# EAGLE design ATtiny2313 pattern generator simple (EAGLE 5.06)
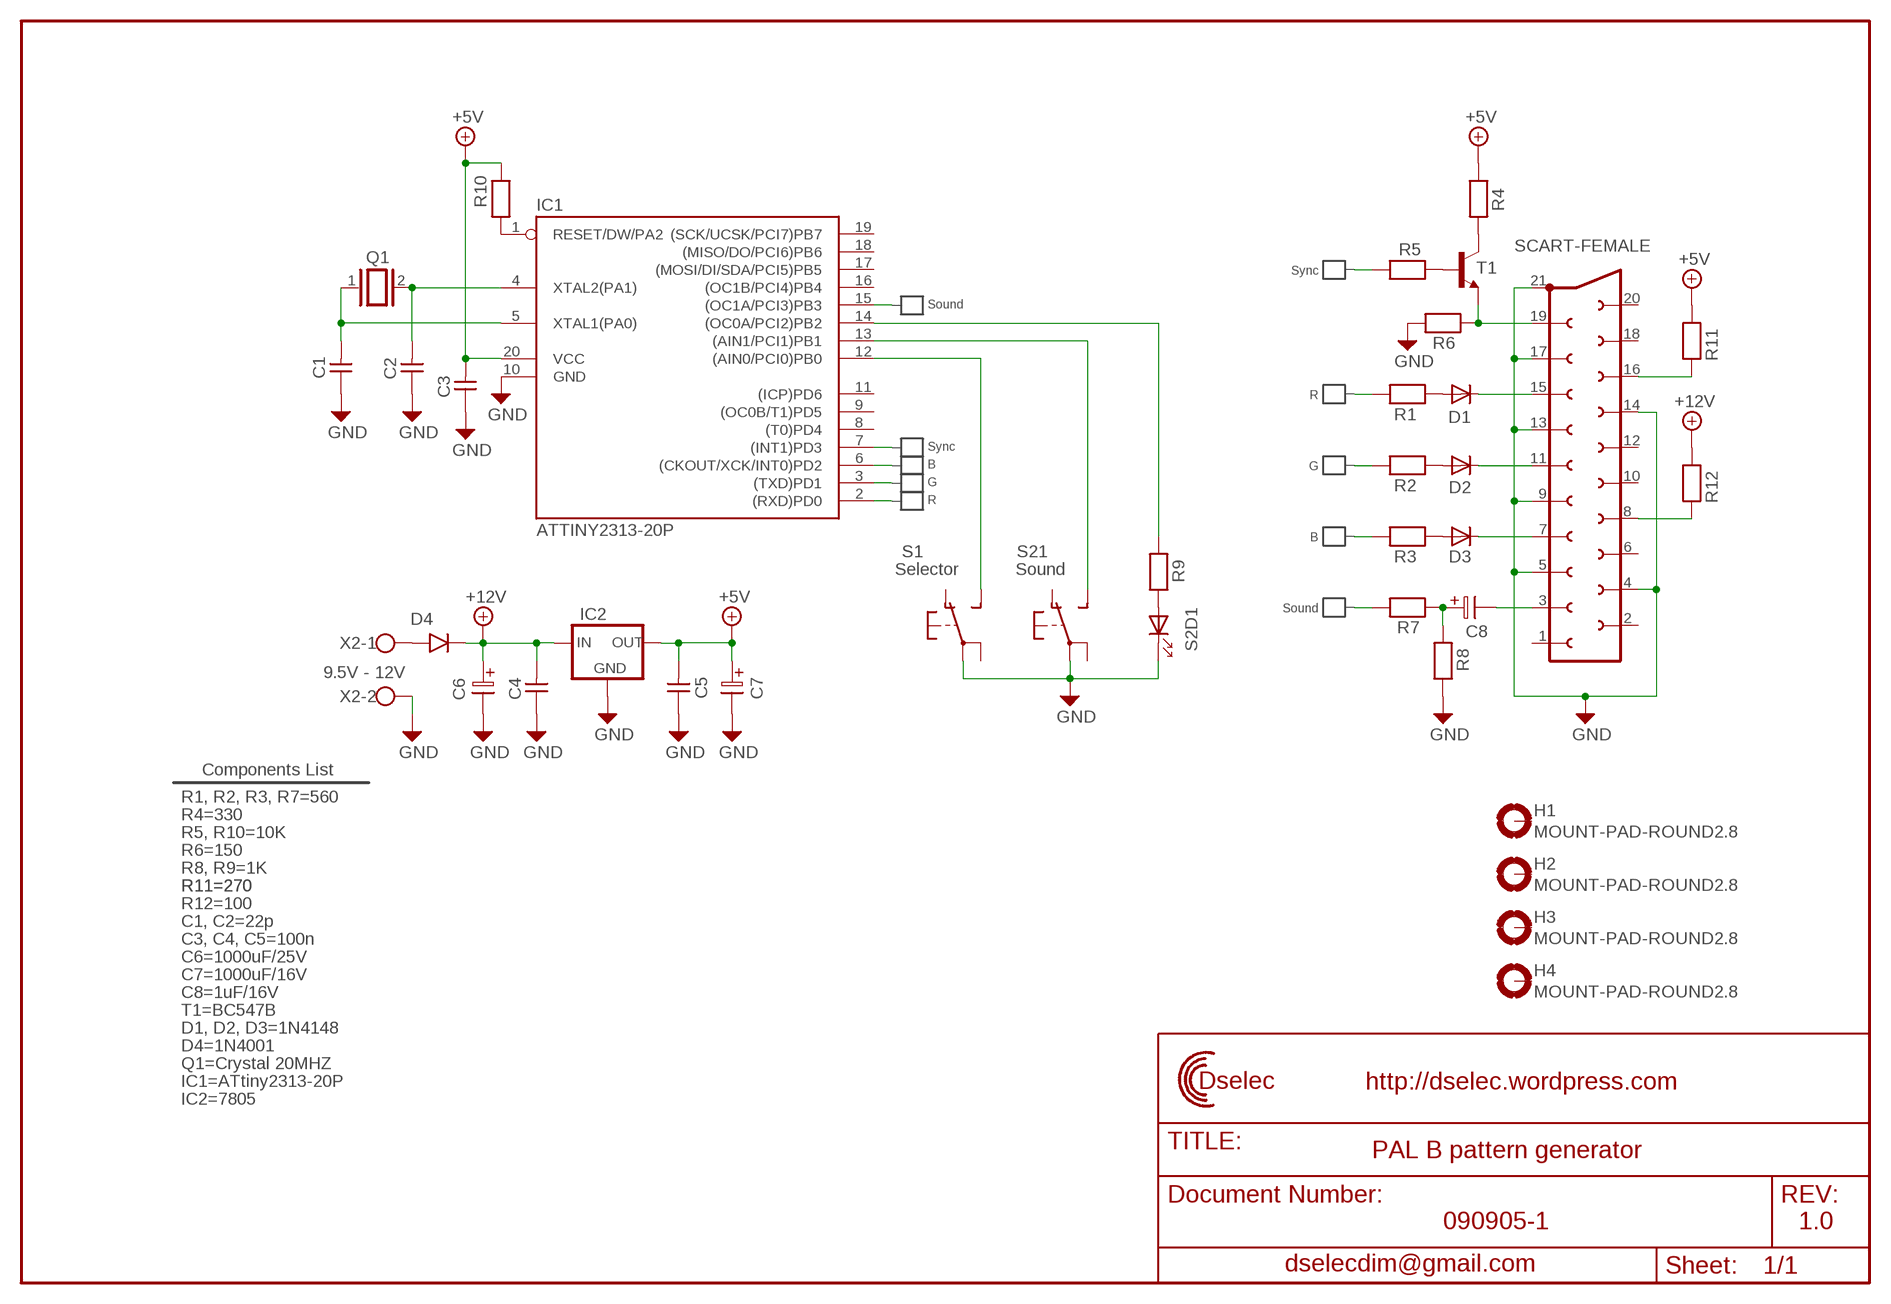
[diagram p0: schematic, sheet 1]

## Parts
C1  CAPNP-5  [C-5]
C2  CAPNP-5  [C-5]
C3  CAPNP-5  [C-5]
C4  CAPNP-5  [C-5]
C5  CAPNP-5  [C-5]
C6  ELC-5  [ES-5]
C7  ELC-5  [ES-5]
C8  ELC-2,5  [ES-2,5]
D1  1N4148  [DO35-10]
D2  1N4148  [DO35-10]
D3  1N4148  [DO35-10]
D4  1N4001  [DO41-10]
H1  MOUNT-PAD-ROUND2.8  [2,8-PAD]
H2  MOUNT-PAD-ROUND2.8  [2,8-PAD]
H3  MOUNT-PAD-ROUND2.8  [2,8-PAD]
H4  MOUNT-PAD-ROUND2.8  [2,8-PAD]
IC1  ATTINY2313-20P  [DIL20]
IC2  78XXS  [78XXS]
Q1  XTAL/S  [QS]
R1  RESEU-10  [R-10]
R2  RESEU-10  [R-10]
R3  RESEU-10  [R-10]
R4  RESEU-10  [R-10]
R5  RESEU-10  [R-10]
R6  RESEU-10  [R-10]
R7  RESEU-10  [R-10]
R8  RESEU-10  [R-10]
R9  RESEU-10  [R-10]
R10  RESEU-10  [R-10]
R11  RESEU-10  [R-10]
R12  RESEU-10  [R-10]
S1  Selector  SRK  [SRK]
S2  Sound  SRKL  [SRKL]
T1  BC547B  BC547B-NPN-TO92-EBC  [TO92-EBC]
X1  SCART-FEMALE  SCART-F  [SCART-F]
X2  AK500/2  [AK500/2]

## Nets
+5V: C3.2 C5.2 C7.1 IC1.20(VCC) IC2.OUT R4.1 R10.1 R11.1
+12V: C4.2 C6.1 D4.C(CATHODE) IC2.IN R12.1
BDRIVE: IC1.6((CKOUT/XCK/INT0)PD2) R3.2
BSCART: D3.A R3.1
GDRIVE: IC1.3((TXD)PD1) R2.2
GND: C1.1 C2.1 C3.1 C4.1 C5.1 C6.2 C7.2 IC1.10(GND) IC2.GND R6.2 R8.2 S1.2(P) S2.2(1:P) S2.-(D1:C) X1.4 X1.5 X1.9 X1.13 X1.14 X1.17 X1.21 X2.2
GSCART: D2.A R2.1
N$1: C2.2 IC1.4(XTAL2(PA1)) Q1.2
N$2: C1.2 IC1.5(XTAL1(PA0)) Q1.1
N$3: D1.C X1.15
N$4: D2.C X1.11
N$5: D3.C X1.7
N$6: C8.2 X1.3
N$7: IC1.1(RESET/DW/PA2) R10.2
N$8: C8.1 R7.2 R8.1
N$9: D4.A(ANODE) X2.1
N$12: R5.1 T1.B
N$13: R4.2 T1.C
N$15: IC1.13((AIN1/PCI1)PB1) S2.1(1:S)
N$16: IC1.12((AIN0/PCI0)PB0) S1.1(S)
N$17: R9.2 S2.+(D1:A)
N$18: IC1.14((OC0A/PCI2)PB2) R9.1
N$19: R11.2 X1.16
N$20: R12.2 X1.8
RDRIVE: IC1.2((RXD)PD0) R1.2
RSCART: D1.A R1.1
SND: IC1.15((OC1A/PCI3)PB3) R7.1
SYNCDRIVE: IC1.7((INT1)PD3) R5.2
SYNCSCART: R6.1 T1.E X1.19
Unconnected: H1.B2,8(MOUNT) H2.B2,8(MOUNT) H3.B2,8(MOUNT) H4.B2,8(MOUNT) IC1.8((T0)PD4) IC1.9((OC0B/T1)PD5) IC1.11((ICP)PD6) IC1.16((OC1B/PCI4)PB4) IC1.17((MOSI/DI/SDA/PCI5)PB5) IC1.18((MISO/DO/PCI6)PB6) IC1.19((SCK/UCSK/PCI7)PB7) S1.3(P) S1.4(O) S2.3(1:P) S2.4(1:O) X1.1 X1.2 X1.6 X1.10 X1.12 X1.18 X1.20

## Notes on the sheet
- 9.5V - 12V
- Components List
- R1, R2, R3, R7=560
- R4=330
- R5, R10=10K
- R6=150
- R8, R9=1K
- R11=270 | R11=270
- R12=100
- C1, C2=22p
- C3, C4, C5=100n
- C6=1000uF/25V
- C7=1000uF/16V
- C8=1uF/16V
- T1=BC547B
- D1, D2, D3=1N4148
- D4=1N4001
- Q1=Crystal 20MHZ
- IC1=ATtiny2313-20P
- IC2=7805
- PAL B pattern generator
- 090905-1 | 1.0

## Library data of the parts
C1-C5 = discrete:CAPNP-5
C6 C7 = discrete:ELC-5
C8 = discrete:ELC-2,5
D1-D3 = diode-1:1N4148: DIODE high speed (Philips)
D4 = tango:1N4001: DIODE general purpose rectifier, 1 A
H1-H4 = holes:MOUNT-PAD-ROUND: MOUNTING PAD, round
IC1 = avr:ATTINY2313: MICROCONTROLLER 2 Kbytes FLASH 128 bytes SRAM 128 bytes EEPROM USART USI
IC2 = v-reg:78XXS: VOLTAGE REGULATOR
Q1 = special:XTAL/S: CRYSTAL
R1-R12 = discrete:RESEU-10
S1 = switch-misc:SRK: SWITCH
S2 = switch-misc:SRKL: SWITCH
T1 = transistor:*-NPN-: NPN Transistror BF959 corrected 2008.03.06
X1 = con-hirschmann:SCART-F: TV SCART CONNECTOR
X2 = con-ptr500+(1):AK500/2: CONNECTOR

## Net classes
0 default: width 0.406 mm

## Board
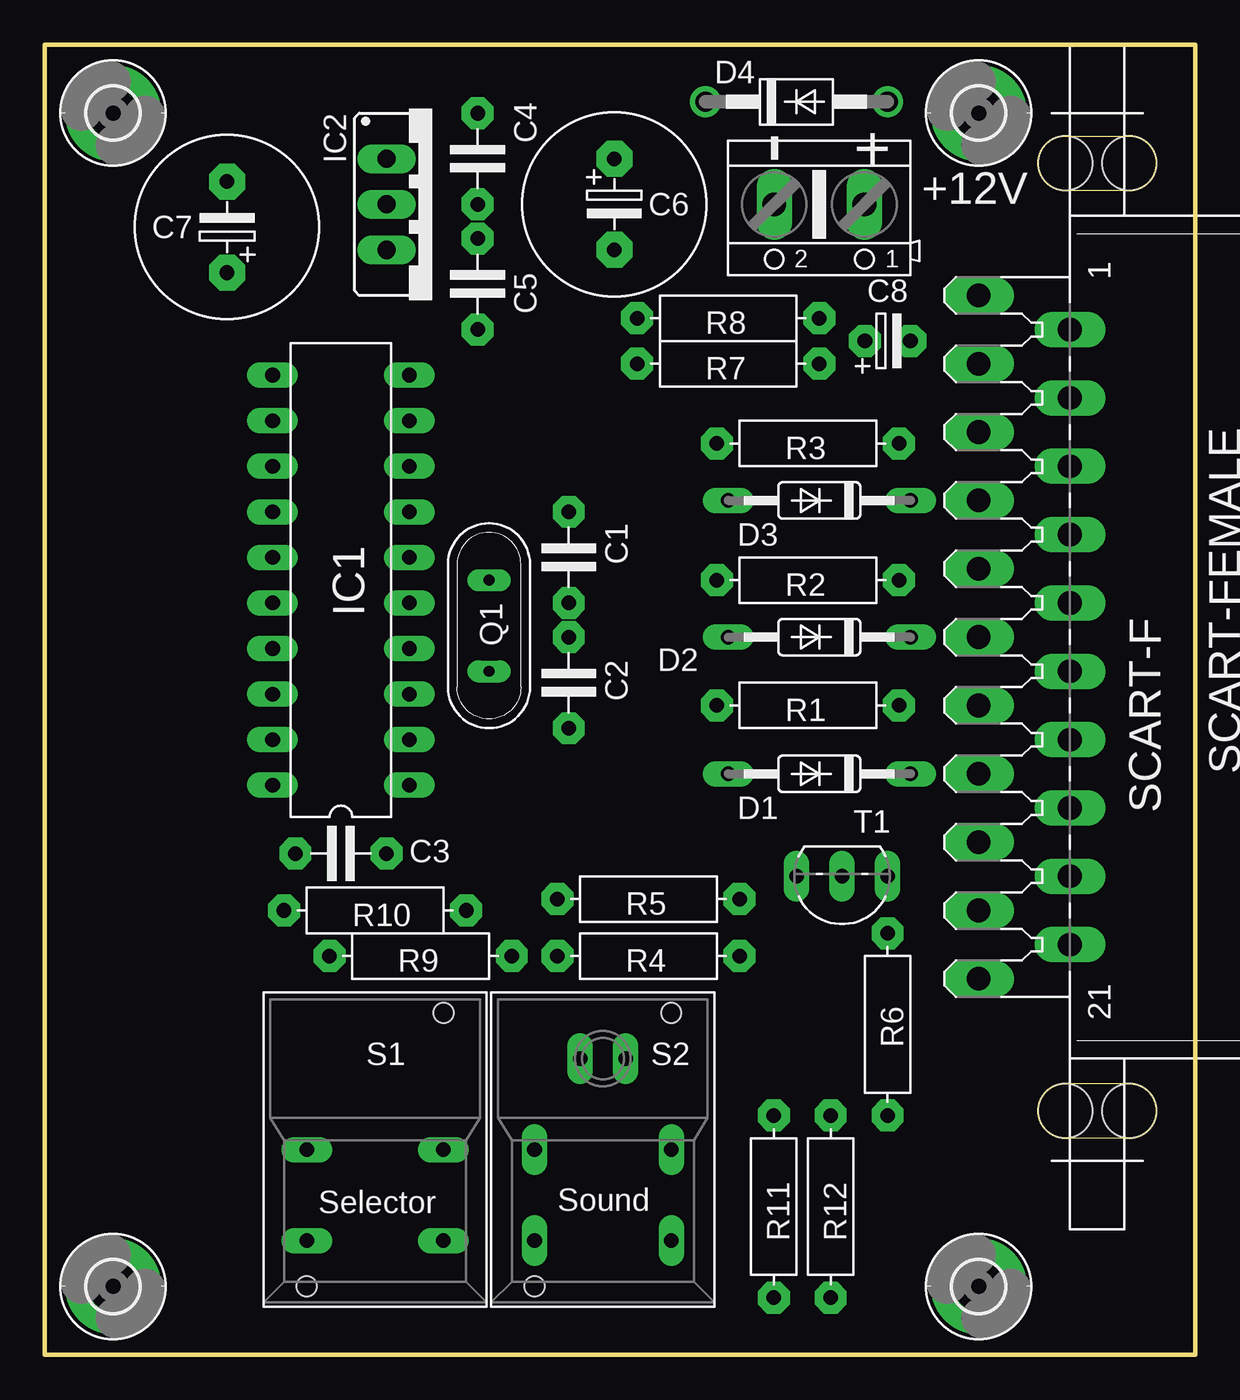
[diagram p1: board, top side]
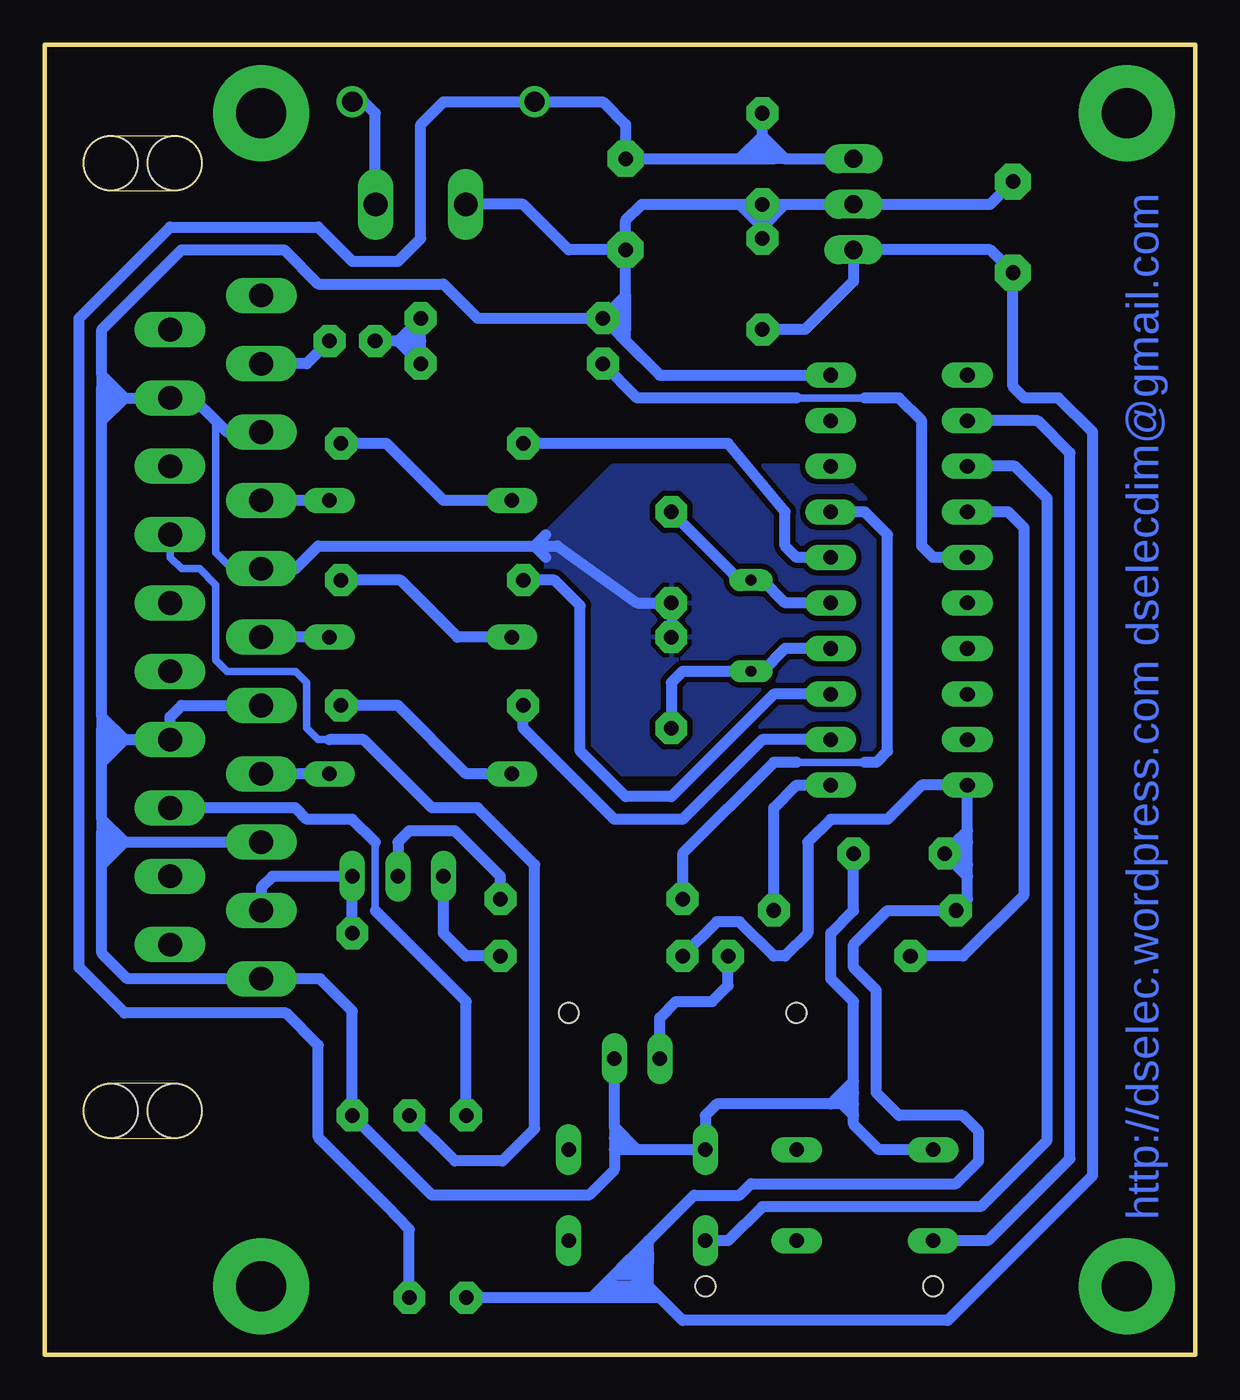
[diagram p2: board, bottom side, seen from below]

Size 64.14 x 73.03 mm. Coordinates in mm from the lower left corner, seen from the top.
Outline: 0,0 0,73.03 64.14,73.03 64.14,0 0,0
Copper layers (1*16): Top 0.035mm / dielectric 1.5mm / Bottom 0.035mm
Design rules "lpkf": minimum track width 10mil, minimum drill 25mil, track to track 12mil, track to pad 12mil, pad to pad 12mil, via to via 12mil, smd to smd 12mil, copper to edge 40mil, drill to drill 8mil, minimum pad ring 12mil, minimum via ring 12mil, stop-mask expansion 0mil, vias tented up to drill 0mil, thermal gap 10mil

### Footprints (pad centres in the part's own frame; a part is rotated, then mirrored left to right if it is on the bottom)
C-5 = drill 0.813 pad 1.778 octagon: 1 -2.54,0; 2 2.54,0
ES-5 = drill 0.813 pad 2.007 octagon: 1 -2.54,0; 2 2.54,0
ES-2,5 = drill 0.813 pad 1.778 octagon: 1 -1.27,0; 2 1.27,0
DO35-10 = drill 0.813 long: A 5.08,0; C -5.08,0
DO41-10 = drill 1.118 round: A 5.08,0; C -5.08,0
2,8-PAD = drill 2.8 pad 5.334 round: B2,8 0,0
DIL20 = drill 0.813 long: 1 -11.43,-3.81; 2 -8.89,-3.81; 3 -6.35,-3.81; 4 -3.81,-3.81; 5 -1.27,-3.81; 6 1.27,-3.81; 7 3.81,-3.81; 8 6.35,-3.81; 9 8.89,-3.81; 10 11.43,-3.81; 11 11.43,3.81; 12 8.89,3.81; 13 6.35,3.81; 14 3.81,3.81; 15 1.27,3.81; 16 -1.27,3.81; 17 -3.81,3.81; 18 -6.35,3.81; 19 -8.89,3.81; 20 -11.43,3.81
78XXS = drill 1.016 long: GND 0,-2.54; IN -2.54,-2.54; OUT 2.54,-2.54
QS = drill 0.61 long: 1 -2.54,0; 2 2.54,0
R-10 = drill 0.813 pad 1.778 octagon: 1 -5.08,0; 2 5.08,0
SRK = drill 0.813 long: 1 -3.81,-5.08; 2 -3.81,0; 3 3.81,0; 4 3.81,-5.08 | hole 1.118: -3.81,-7.62; 3.81,7.62
SRKL = drill 0.813 long: 1 -3.81,-5.08; 2 -3.81,0; 3 3.81,0; 4 3.81,-5.08; + -1.27,5.08; - 1.27,5.08 | hole 1.118: 3.81,7.62; -3.81,-7.62
TO92-EBC = drill 0.813 long: B 0,-1.27; C 2.54,-1.27; E -2.54,-1.27
SCART-F = drill 1.321 long: 1 19.05,5.08; 2 17.145,0; 3 15.24,5.08; 4 13.335,0; 5 11.43,5.08; 6 9.525,0; 7 7.62,5.08; 8 5.715,0; 9 3.81,5.08; 10 1.905,0; 11 0,5.08; 12 -1.905,0; 13 -3.81,5.08; 14 -5.715,0; 15 -7.62,5.08; 16 -9.525,0; 17 -11.43,5.08; 18 -13.335,0; 19 -15.24,5.08; 20 -17.145,0; 21 -19.05,5.08 | hole 3.023: 26.416,0.254; 26.416,-3.302; -26.416,0.254; -26.416,-3.302
AK500/2 = drill 1.321 long: 1 -2.515,0; 2 2.515,0

### Placement (x,y rotation side)
C1  29.21,44.45 90 top
C2  29.21,37.47 270 top
C3  16.51,27.94 180 top
C4  24.13,66.67 90 top
C5  24.13,59.69 270 top
C6  31.75,64.14 270 top
C7  10.16,62.87 90 top
C8  46.99,56.52 0 top
D1  43.18,32.38 180 top
D2  43.18,40.01 180 top
D3  43.18,47.62 180 top
D4  41.91,69.85 0 top
H1  3.81,3.81 270 top
H2  52.07,69.22 270 top
H3  52.07,3.81 270 top
H4  3.81,69.22 270 top
IC1  16.51,43.18 90 top
IC2  21.59,64.14 270 top
Q1  24.77,40.64 270 top
R1  42.55,36.2 180 top
R2  42.55,43.18 180 top
R3  42.55,50.8 180 top
R4  33.66,22.23 0 top
R5  33.66,25.4 180 top
R6  46.99,18.41 270 top
R7  38.1,55.24 0 top
R8  38.1,57.78 180 top
R9  20.95,22.23 0 top
R10  18.41,24.77 0 top
R11  40.64,8.26 90 top
R12  43.81,8.26 90 top
S1  18.41,11.43 0 top
S2  31.11,11.43 0 top
T1  44.45,25.4 180 top
X1  57.15,40.01 90 top
X2  43.18,64.14 180 top

### Tracks (layer width: path | path; a pad name or v marks a point on that pad's centre or on a via)
+5V
  Bottom 0.61: C5.2 21.74,57.15 19.05,59.84 IC2.OUT 11.43,61.59 C7.1 10.16,53.98 9.53,53.34 7.62,53.34 5.71,51.44 5.71,9.99 13.8,1.91 28.57,1.91 29.84,3.17 | 13.34,28.57 C3.2 13.34,27.3 | 13.34,28.57 12.7,29.21 | 12.7,29.21 IC1.20 15.24,31.75 17.14,29.84 20.32,29.84 21.59,28.57 21.59,23.5 22.86,22.23 23.5,22.23 25.4,24.13 26.67,24.13 R4.1 | 31.75,5.08 31.11,5.71 | 31.11,5.71 30.48,6.35 | 30.48,6.35 27.94,8.89 25.4,8.89 24.77,9.53 13.34,9.53 12.06,10.79 12.06,12.44 12.96,13.34 16.51,13.34 17.78,14.61 17.78,20.32 19.05,21.59 19.05,22.86 17.14,24.77 R10.1 12.7,25.4 12.7,26.67 | 31.75,5.08 32.38,4.45 | 32.38,4.45 33.02,3.81 | 33.66,3.17 33.02,3.81 | 33.66,3.17 R11.1 | 29.84,3.17 30.48,3.81 | 30.48,3.81 31.11,4.45 | 31.11,4.45 31.75,5.08 | 31.11,4.45 32.38,4.45 | 31.11,4.45 31.11,5.71 | 30.48,5.71 30.48,6.35 | 30.48,4.45 30.48,5.71 | 30.48,3.81 30.48,4.45 | 30.48,3.81 31.11,3.81 | 31.11,3.81 32.38,3.81 | 32.38,3.81 33.02,3.81 | 31.11,3.81 31.11,4.45 | 31.11,4.45 31.11,5.08 30.48,5.71 | 30.48,5.71 30.48,5.08 31.11,4.45 | 31.11,4.45 30.48,4.45 | 33.02,3.17 33.66,3.17 | 31.75,3.17 33.02,3.17 | 30.48,3.17 31.75,3.17 | 29.84,3.17 30.48,3.17 | 30.48,3.17 31.11,3.81 | 31.75,3.17 31.11,3.81 | 31.75,3.17 32.38,3.81 | 32.38,3.81 33.02,3.17 | 12.7,26.67 13.34,27.3 | 13.34,27.94 13.34,28.57 | 13.34,27.3 13.34,27.94 | 12.7,28.57 12.7,29.21 | 12.7,27.3 12.7,28.57 | 12.7,26.67 12.7,27.3 | 12.7,28.57 13.34,27.94 | 12.7,27.3 13.34,27.94
+12V
  Bottom 0.61: 24.13,66.67 23.5,66.67 | 22.86,66.67 23.5,66.67 | 22.86,66.67 IC2.IN | 25.4,66.67 C6.1 31.75,68.58 33.02,69.85 D4.C 41.91,69.85 43.18,68.58 43.18,62.23 44.45,60.96 46.99,60.96 48.9,62.87 57.15,62.87 62.23,57.78 62.23,21.59 59.69,19.05 50.69,19.05 48.9,17.25 48.9,12.12 45.03,8.26 43.81,6.99 R12.1 | 25.4,66.67 24.77,66.67 | 24.77,66.67 24.13,66.67 | 24.13,67.31 24.13,66.67 | 24.13,67.94 24.13,67.31 | 24.13,67.94 C4.2 | 24.77,66.67 24.13,67.31 | 24.13,67.31 23.5,66.67 | 24.13,67.94 22.86,66.67 | 25.4,66.67 24.13,67.94
BDRIVE
  Bottom 0.61: IC1.6 22.23,44.45 22.86,45.09 22.86,46.99 26.04,50.8 R3.2
BSCART
  Bottom 0.61: R3.1 45.09,50.8 41.91,47.62 D3.A
GDRIVE
  Bottom 0.61: R2.2 35.71,43.18 34.29,41.76 34.29,33.66 31.75,31.11 29.21,31.11 23.5,36.83 IC1.3
GND
  Bottom 0.406: 54.61,52.07 54.61,44.71 53.71,43.81 X1.9
  Bottom 0.61: C4.1 22.86,64.14 | 22.86,64.14 IC2.GND 11.43,64.14 C7.2 | R8.2 32.38,57.15 | 32.38,57.15 31.75,56.52 | 29.84,54.61 31.75,56.52 | 29.84,54.61 IC1.10 | R8.2 32.38,58.42 | 32.38,58.42 31.75,59.05 | 31.75,59.05 C6.2 | C6.2 31.75,63.24 30.85,64.14 25.4,64.14 | 25.4,64.14 C4.1 | C4.1 24.13,62.87 | 24.13,62.87 C5.1 | S1.2 17.63,11.43 19.05,12.85 19.05,13.34 | 19.05,13.34 19.05,13.97 | 19.05,13.97 19.68,13.97 | 19.68,13.97 20.32,13.97 | 20.32,13.97 26.67,13.97 27.3,13.34 S2.2 31.11,11.43 | 31.11,11.43 31.75,11.43 | 31.75,11.43 32.38,11.43 | 19.05,13.97 19.05,14.61 | 19.05,14.61 19.05,15.24 | 19.05,15.24 19.05,19.68 20.32,20.95 20.32,23.5 19.05,24.77 C3.1 | C2.1 C1.1 31.11,41.91 35.56,45.09 36.83,45.09 | 60.96,27.3 60.96,22.38 59.54,20.95 X1.21 48.79,20.95 46.99,19.16 R6.2 42.55,8.89 33.8,8.89 32.38,10.31 32.38,11.43 | 60.96,27.3 60.96,27.94 | 60.96,27.94 60.96,28.57 | X1.13 56.52,36.2 57.15,35.56 X1.14 59.69,34.29 | X1.5 53.98,51.44 54.61,52.07 55.88,53.34 X1.4 59.69,53.34 | 60.96,34.29 60.96,34.92 | 60.96,35.56 60.96,34.92 | 60.96,35.56 60.96,52.07 | 60.96,52.07 60.96,52.7 | 60.96,52.7 60.96,53.34 | 60.33,34.29 60.96,34.29 | 59.69,34.29 60.33,34.29 | 60.96,28.57 60.96,29.21 | 60.96,29.84 60.96,29.21 | 60.96,29.84 60.96,33.02 | 60.96,33.02 60.96,33.66 | 60.96,33.66 60.96,34.29 | 60.33,28.57 60.96,28.57 | 59.69,28.57 60.33,28.57 | 59.69,28.57 X1.17 | 32.38,12.7 S2.- | 32.38,12.7 32.38,12.06 | 32.38,12.06 32.38,11.43 | 19.68,13.97 19.05,14.61 | 19.05,13.34 19.68,13.97 | 20.32,13.97 19.05,15.24 | 31.75,11.43 32.38,12.06 | 31.11,11.43 32.38,12.7 | 60.96,53.34 60.96,53.98 | 60.96,54.61 60.96,53.98 | 60.96,54.61 60.96,57.15 56.52,61.59 50.8,61.59 48.9,59.69 41.91,59.69 40.01,57.78 R8.2
  Bottom 0.61: 59.69,53.34 60.33,53.34 | 60.33,53.34 60.96,53.34 | 60.33,53.34 60.96,53.98 | 60.96,52.7 60.33,53.34 | 59.69,53.34 60.96,54.61 | 60.96,52.07 59.69,53.34 | 60.33,34.29 60.96,34.92 | 60.96,33.66 60.33,34.29 | 59.69,34.29 60.96,35.56 | 60.96,33.02 59.69,34.29 | 60.33,28.57 60.96,29.21 | 60.96,27.94 60.33,28.57 | 59.69,28.57 60.96,29.84 | 60.96,27.3 59.69,28.57 | X1.9 50.16,43.81 48.9,45.09 36.83,45.09 | 36.83,45.09 36.2,44.45 | 24.13,62.87 22.86,64.14 | 25.4,64.14 24.13,62.87 | 32.38,58.42 32.38,57.78 | 32.38,57.15 32.38,57.78 | 31.75,59.05 31.75,58.42 | 31.75,58.42 31.75,57.15 | 31.75,56.52 31.75,57.15 | 32.38,57.78 31.75,58.42 | 32.38,57.78 31.75,57.15 | 36.83,45.09 36.2,45.72 | X2.2 37.47,64.14 34.92,61.59 C6.2 | R8.2 29.84,54.61
  pour Bottom: 16.51,34.92 18.41,32.38 34.29,32.38 36.2,34.29 36.2,45.83 32.49,49.53 20.21,49.53 16.51,45.83
GSCART
  Bottom 0.61: D2.A 41.12,40.01 44.3,43.18 R2.1
N$1
  Bottom 0.61: C2.2 29.21,37.47 28.57,38.1 Q1.2 24.13,38.1 22.86,39.37 IC1.4
N$2
  Bottom 0.61: C1.2 25.4,43.18 Q1.1 24.13,43.18 22.86,41.91 IC1.5
N$3
  Bottom 0.61: D1.C X1.15
N$4
  Bottom 0.61: D2.C X1.11
N$5
  Bottom 0.61: D3.C X1.7
N$6
  Bottom 0.61: C8.2 49.53,55.24 X1.3
N$7
  Bottom 0.61: IC1.1 22.23,31.75 23.5,30.48 R10.2
N$8
  Bottom 0.61: 43.81,56.52 43.18,56.52 | 44.45,56.52 C8.1 | 43.18,55.88 R7.2 44.45,56.52 | 43.18,55.88 43.18,56.52 | 43.18,56.52 43.18,57.15 | 43.18,57.15 R8.1 44.45,56.52 | 44.45,56.52 43.81,56.52 | 43.81,56.52 43.18,57.15 | 43.18,55.88 43.18,57.15 | 43.18,55.88 43.81,56.52
N$9
  Bottom 0.61: D4.A 46.35,69.85 45.72,69.22 45.72,64.16 X2.1
N$12
  Bottom 0.61: T1.B 44.45,28.57 43.81,29.21 41.27,29.21 38.73,26.67 R5.1
N$13
  Bottom 0.61: R4.2 40.64,22.23 41.91,23.5 T1.C
N$15
  Bottom 0.61: S2.1 26.04,6.35 24.13,8.26 11.96,8.26 8.26,11.96 8.26,47.73 10.05,49.53 IC1.13
N$16
  Bottom 0.61: S1.1 11.56,6.35 6.99,10.93 6.99,50.27 8.78,52.07 IC1.12
N$17
  Bottom 0.61: S2.+ 29.84,18.79 28.95,19.68 26.93,19.68 26.04,20.58 R9.2
N$18
  Bottom 0.61: IC1.14 10.42,46.99 9.53,46.09 9.53,25.64 12.94,22.23 R9.1
N$19
  Bottom 0.406: 45.72,24.77 45.72,28.57
  Bottom 0.61: 45.72,24.77 40.64,19.68 R11.2 | 45.72,28.57 46.99,29.84 49.53,29.84 50.16,30.48 X1.16
N$20
  Bottom 0.406: 48.26,34.29 48.9,34.29 49.53,34.92 49.53,37.47 50.16,38.1 53.98,38.1 54.61,38.73 54.61,42.92 55.51,43.81 56.52,43.81 57.15,44.45 X1.8
  Bottom 0.61: R12.2 41.27,10.79 38.63,10.79 36.83,12.59 36.83,27.3 40.01,30.48 42.55,30.48 46.35,34.29 48.26,34.29
RDRIVE
  Bottom 0.61: R1.2 37.47,34.92 32.38,29.84 28.57,29.84 24.13,34.29 IC1.2
RSCART
  Bottom 0.61: D1.A 40.64,32.38 44.45,36.2 R1.1
SND
  Bottom 0.406: 18.41,53.34 22.23,53.34
  Bottom 0.61: R7.1 31.11,53.34 22.23,53.34 | IC1.15 14.61,44.45 15.24,45.09 15.24,52.07 16.51,53.34 18.41,53.34
SYNCDRIVE
  Bottom 0.406: 18.41,33.02 22.23,33.02
  Bottom 0.61: 18.41,33.02 17.78,33.02 17.14,33.66 17.14,45.72 18.41,46.99 IC1.7 | 22.23,33.02 23.5,33.02 28.57,27.94 R5.2
SYNCSCART
  Bottom 0.61: R6.1 T1.E 51.44,26.67 52.07,26.04 X1.19

### Text on the board
Bottom: dselecdim@gmail.com | http://dselec.wordpress.com
tNames: - | + | +12V